# Altium schematic sheet TEENSY 3.SchDoc
size A4; SheetNumber: 5; SheetTotal: 6
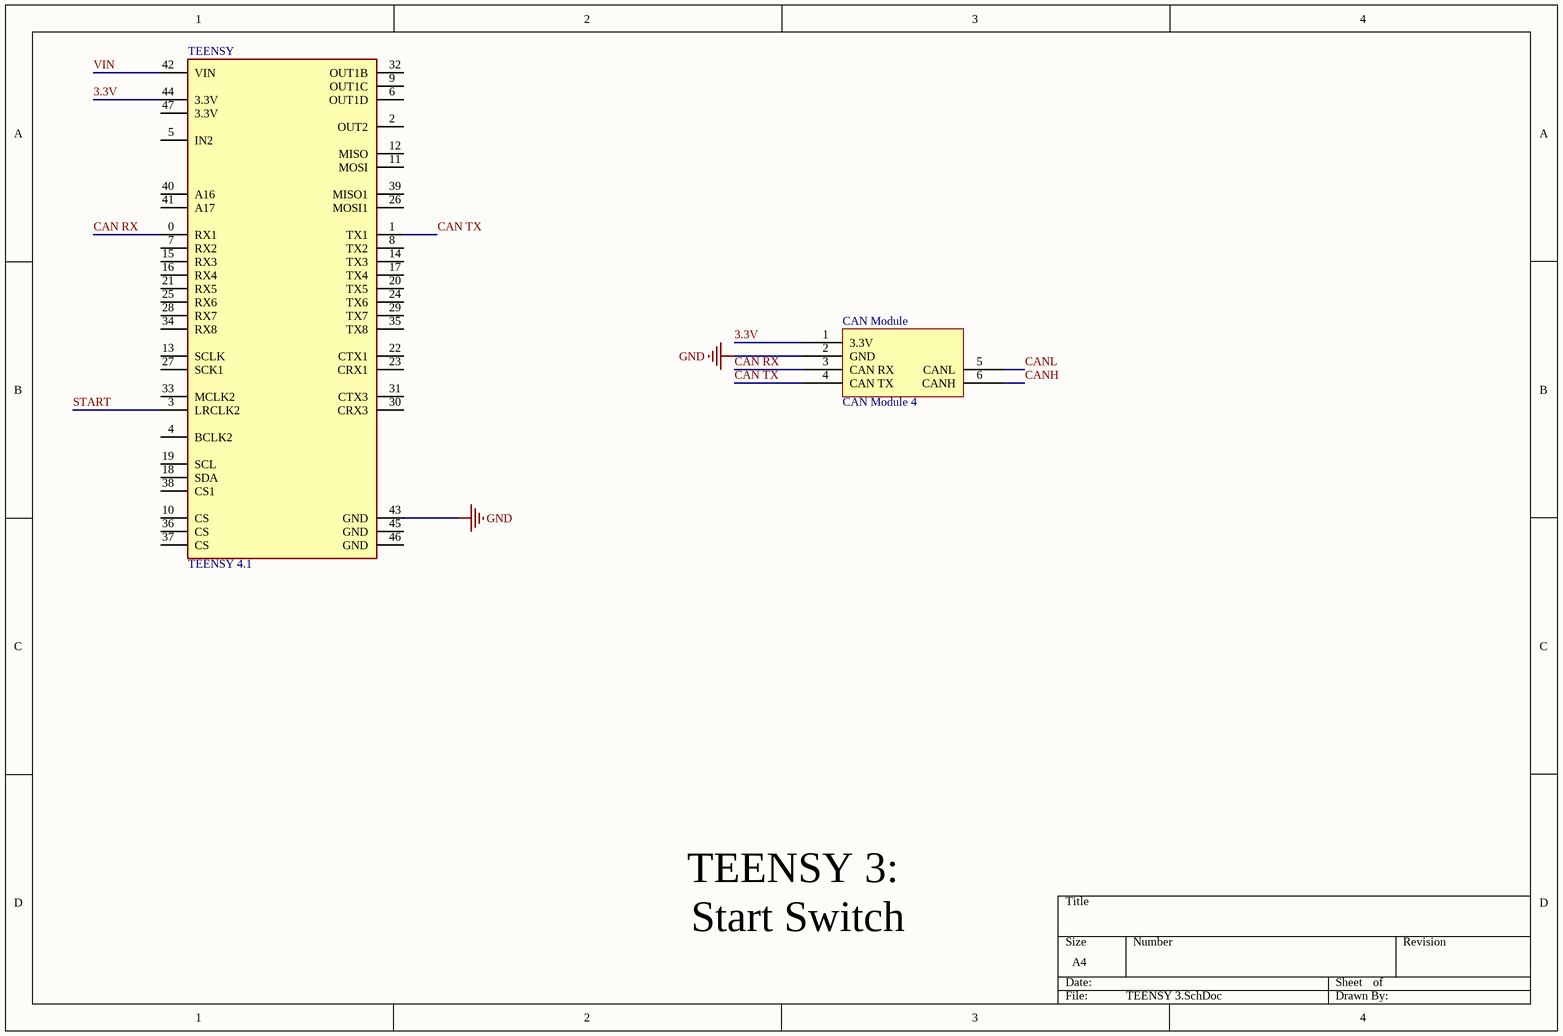
[diagram p0: TEENSY 3.SchDoc]

## Parts
CAN_Module  CAN Module 4  [CAN Module-Footprint-1]
TEENSY  TEENSY 4.1  [FP-DEV-16996-MFG]

## Nets
GND: CAN_Module.2(GND) TEENSY.43(GND)
3.3V: CAN_Module.1(3.3V) TEENSY.44(3.3V)
CAN RX: CAN_Module.3(CAN_RX) TEENSY.0(RX1)
CAN TX: CAN_Module.4(CAN_TX) TEENSY.1(TX1)
CANH: CAN_Module.6(CANH)
CANL: CAN_Module.5(CANL)
START: TEENSY.3(LRCLK2)
VIN: TEENSY.42(VIN)

Not connected (* = marked no-connect by the designer): TEENSY 2(OUT2) 4(BCLK2) 5(IN2) 6(OUT1D) 7(RX2) 8(TX2) 9(OUT1C) 10(CS) 11(MOSI) 12(MISO) 13(SCLK) 14(TX3) 15(RX3) 16(RX4) 17(TX4) 18(SDA) 19(SCL) 20(TX5) 21(RX5) 22(CTX1) 23(CRX1) 24(TX6) 25(RX6) 26(MOSI1) 27(SCK1) 28(RX7) 29(TX7) 30(CRX3) 31(CTX3) 32(OUT1B) 33(MCLK2) 34(RX8) 35(TX8) 36(CS) 37(CS) 38(CS1) 39(MISO1) 40(A16) 41(A17) 45(GND) 46(GND) 47(3.3V)

## Notes on the sheet
- TEENSY 3:
  Start Switch

## Library data of the parts
CAN_Module = CMP-00030-00003-1: CAN waveshare
TEENSY = CMP-157412-000001-1: TEENSY 4.1 (HEADERS)